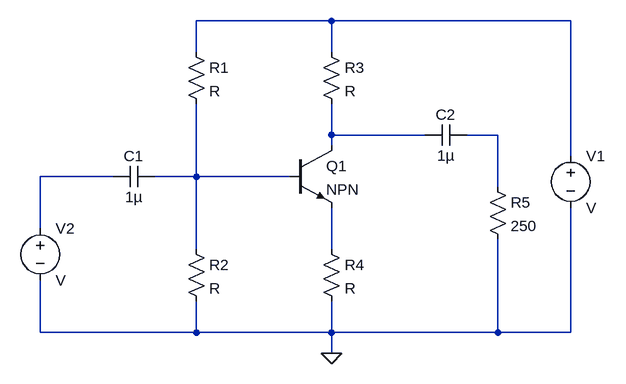
[diagram p0: schematic Draft4.asc]
Draft4.asc, the LTspice schematic file:
Version 4
SHEET 1 880 680
WIRE 448 80 240 80
WIRE 816 80 448 80
WIRE 240 128 240 80
WIRE 448 128 448 80
WIRE 448 256 448 208
WIRE 592 256 448 256
WIRE 704 256 656 256
WIRE 448 272 448 256
WIRE 816 288 816 80
WIRE 112 320 0 320
WIRE 240 320 240 208
WIRE 240 320 176 320
WIRE 384 320 240 320
WIRE 704 336 704 256
WIRE 0 400 0 320
WIRE 240 432 240 320
WIRE 448 432 448 368
WIRE 0 560 0 480
WIRE 240 560 240 512
WIRE 240 560 0 560
WIRE 448 560 448 512
WIRE 448 560 240 560
WIRE 704 560 704 416
WIRE 704 560 448 560
WIRE 816 560 816 368
WIRE 816 560 704 560
WIRE 448 592 448 560
FLAG 448 592 0
SYMBOL npn 384 272 R0
SYMATTR InstName Q1
SYMBOL Res 224 112 R0
SYMATTR InstName R1
SYMBOL Res 224 416 R0
SYMATTR InstName R2
SYMBOL Res 432 112 R0
SYMATTR InstName R3
SYMBOL Res 432 416 R0
SYMATTR InstName R4
SYMBOL Cap 176 304 R90
WINDOW 0 0 32 VBottom 2
WINDOW 3 32 32 VTop 2
SYMATTR InstName C1
SYMATTR Value 1µ
SYMBOL Cap 656 240 R90
WINDOW 0 0 32 VBottom 2
WINDOW 3 32 32 VTop 2
SYMATTR InstName C2
SYMATTR Value 1µ
SYMBOL Res 688 320 R0
SYMATTR InstName R5
SYMATTR Value 250
SYMBOL Voltage 816 272 R0
SYMATTR InstName V1
SYMBOL Voltage 0 384 R0
SYMATTR InstName V2

The netlist it stands for:
* Draft4.asc
Q1 N002 N005 N006 0 NPN
R1 N001 N005 R
R2 N005 0 R
R3 N001 N002 R
R4 N006 0 R
C1 N005 N004 1µ
C2 N003 N002 1µ
R5 N003 0 250
V1 N001 0 V
V2 N004 0 V
.model NPN NPN
.model PNP PNP
.lib standard.bjt
.backanno
.end